# EAGLE design WindVane (EAGLE 9.6.2)
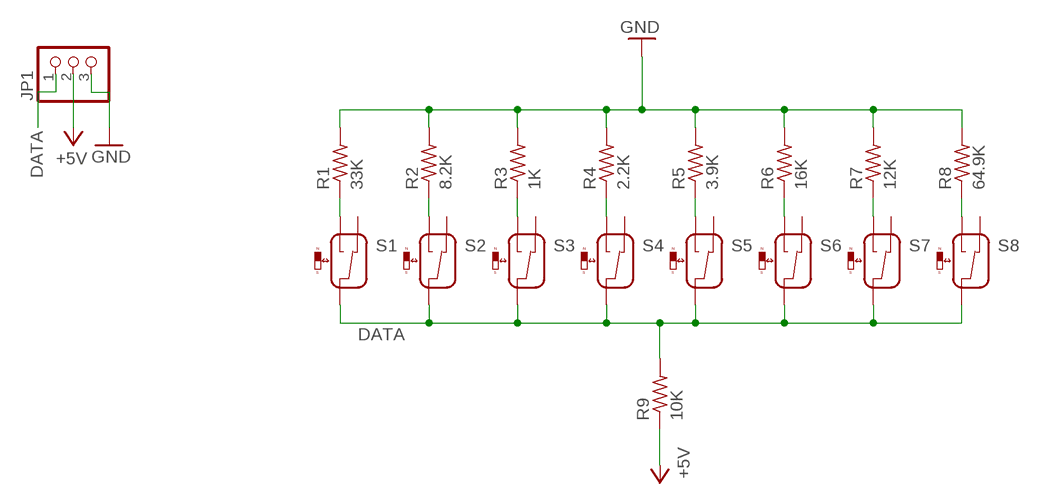
[diagram p0: schematic, sheet 1]

## Parts
JP1  PINHD-1X3/90  [1X03/90]
R1  33K  R-US_0207/10  [0207/10]
R2  8.2K  R-US_0207/10  [0207/10]
R3  1K  R-US_0207/10  [0207/10]
R4  2.2K  R-US_0207/10  [0207/10]
R5  3.9K  R-US_0207/10  [0207/10]
R6  16K  R-US_0207/10  [0207/10]
R7  12K  R-US_0207/10  [0207/10]
R8  64.9K  R-US_0207/10  [0207/10]
R9  10K  R-US_0207/10  [0207/10]
S1  REED-SWITCH-NO-NC  [MK6-8-C]
S2  REED-SWITCH-NO-NC  [MK6-8-C]
S3  REED-SWITCH-NO-NC  [MK6-8-C]
S4  REED-SWITCH-NO-NC  [MK6-8-C]
S5  REED-SWITCH-NO-NC  [MK6-8-C]
S6  REED-SWITCH-NO-NC  [MK6-8-C]
S7  REED-SWITCH-NO-NC  [MK6-8-C]
S8  REED-SWITCH-NO-NC  [MK6-8-C]

## Nets
+5V: JP1.2 R9.1
DATA: JP1.1 R9.2 S1.COM S2.COM S3.COM S4.COM S5.COM S6.COM S7.COM S8.COM
GND: JP1.3 R1.2 R2.2 R3.2 R4.2 R5.2 R6.2 R7.2 R8.2
N$2: R1.1 S1.NO
N$3: R2.1 S2.NO
N$4: R3.1 S3.NO
N$5: R4.1 S4.NO
N$6: R5.1 S5.NO
N$7: R6.1 S6.NO
N$8: R7.1 S7.NO
N$9: R8.1 S8.NO
Unconnected: S1.NC S2.NC S3.NC S4.NC S5.NC S6.NC S7.NC S8.NC

## Library data of the parts
JP1 = pinhead:PINHD-1X3: PIN HEADER
R1-R9 = rcl:R-US_: RESISTOR, American symbol; SPICEPREFIX: R
S1-S8 = switch-reed:REED-SWITCH-NO-NC: Reed Sensor NO NC

## Board
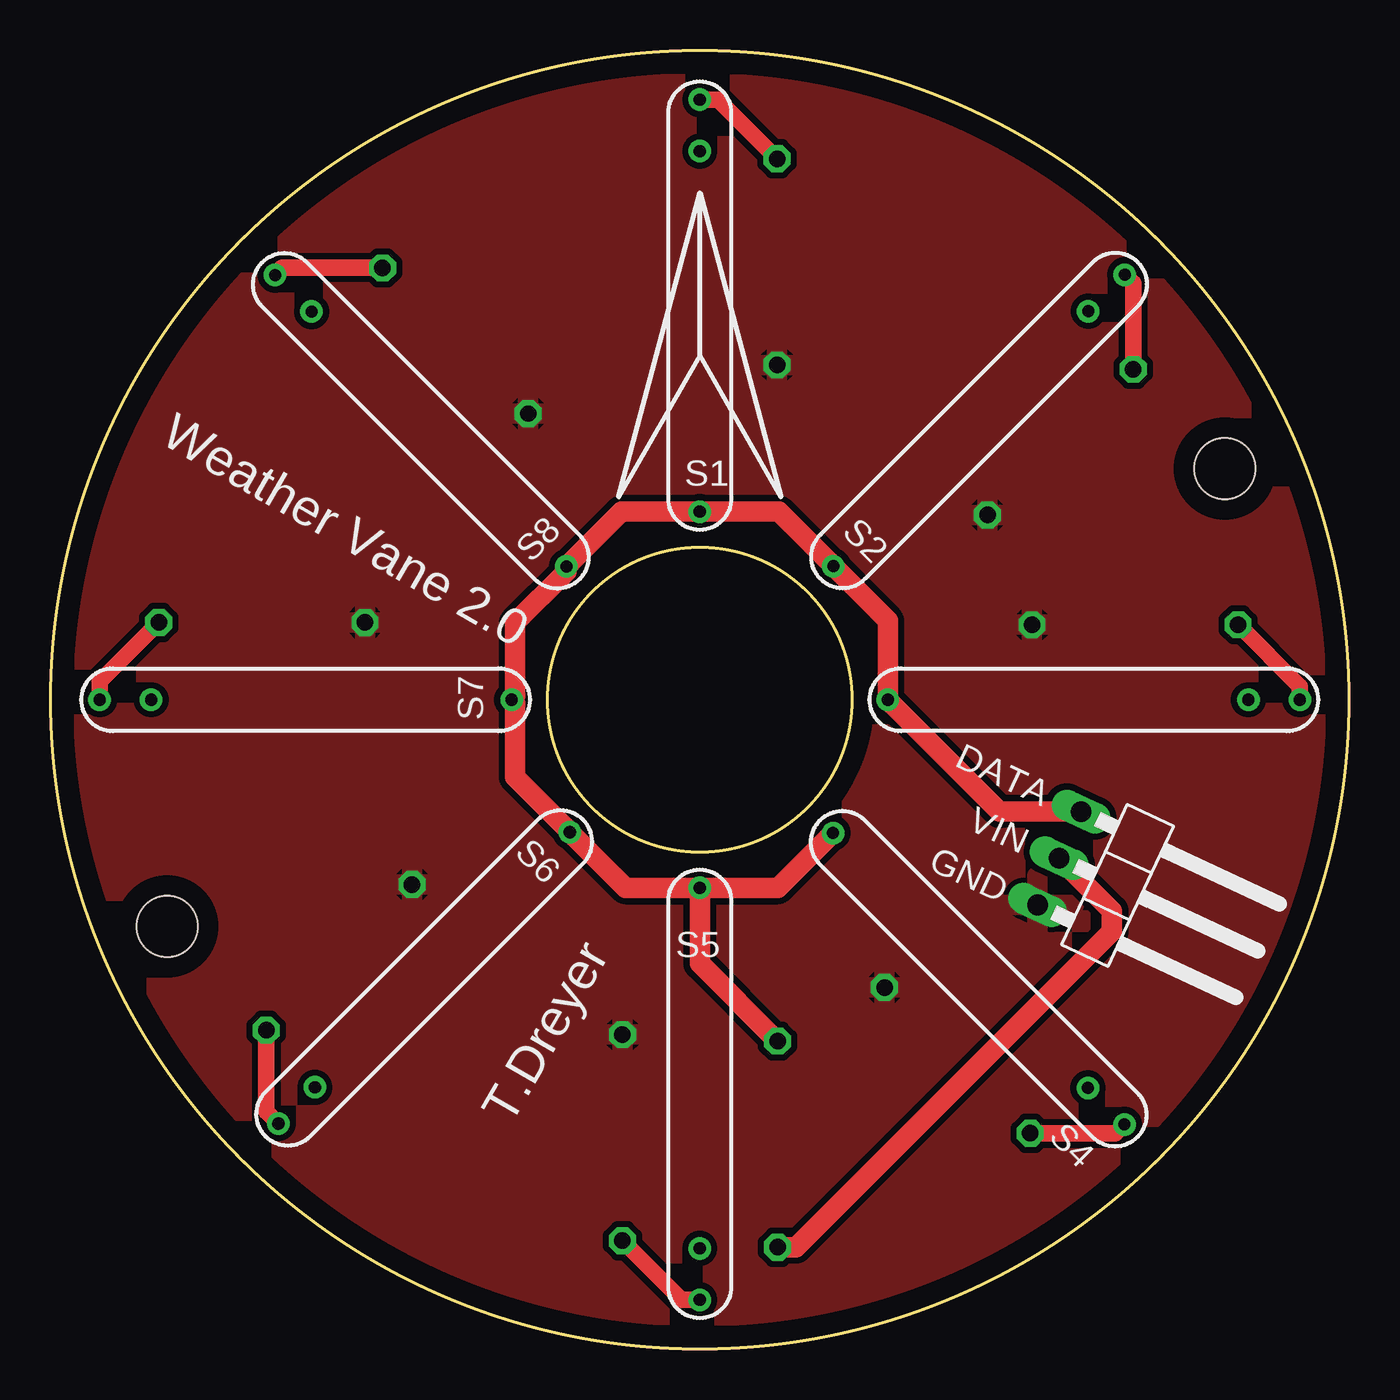
[diagram p1: board, top side]
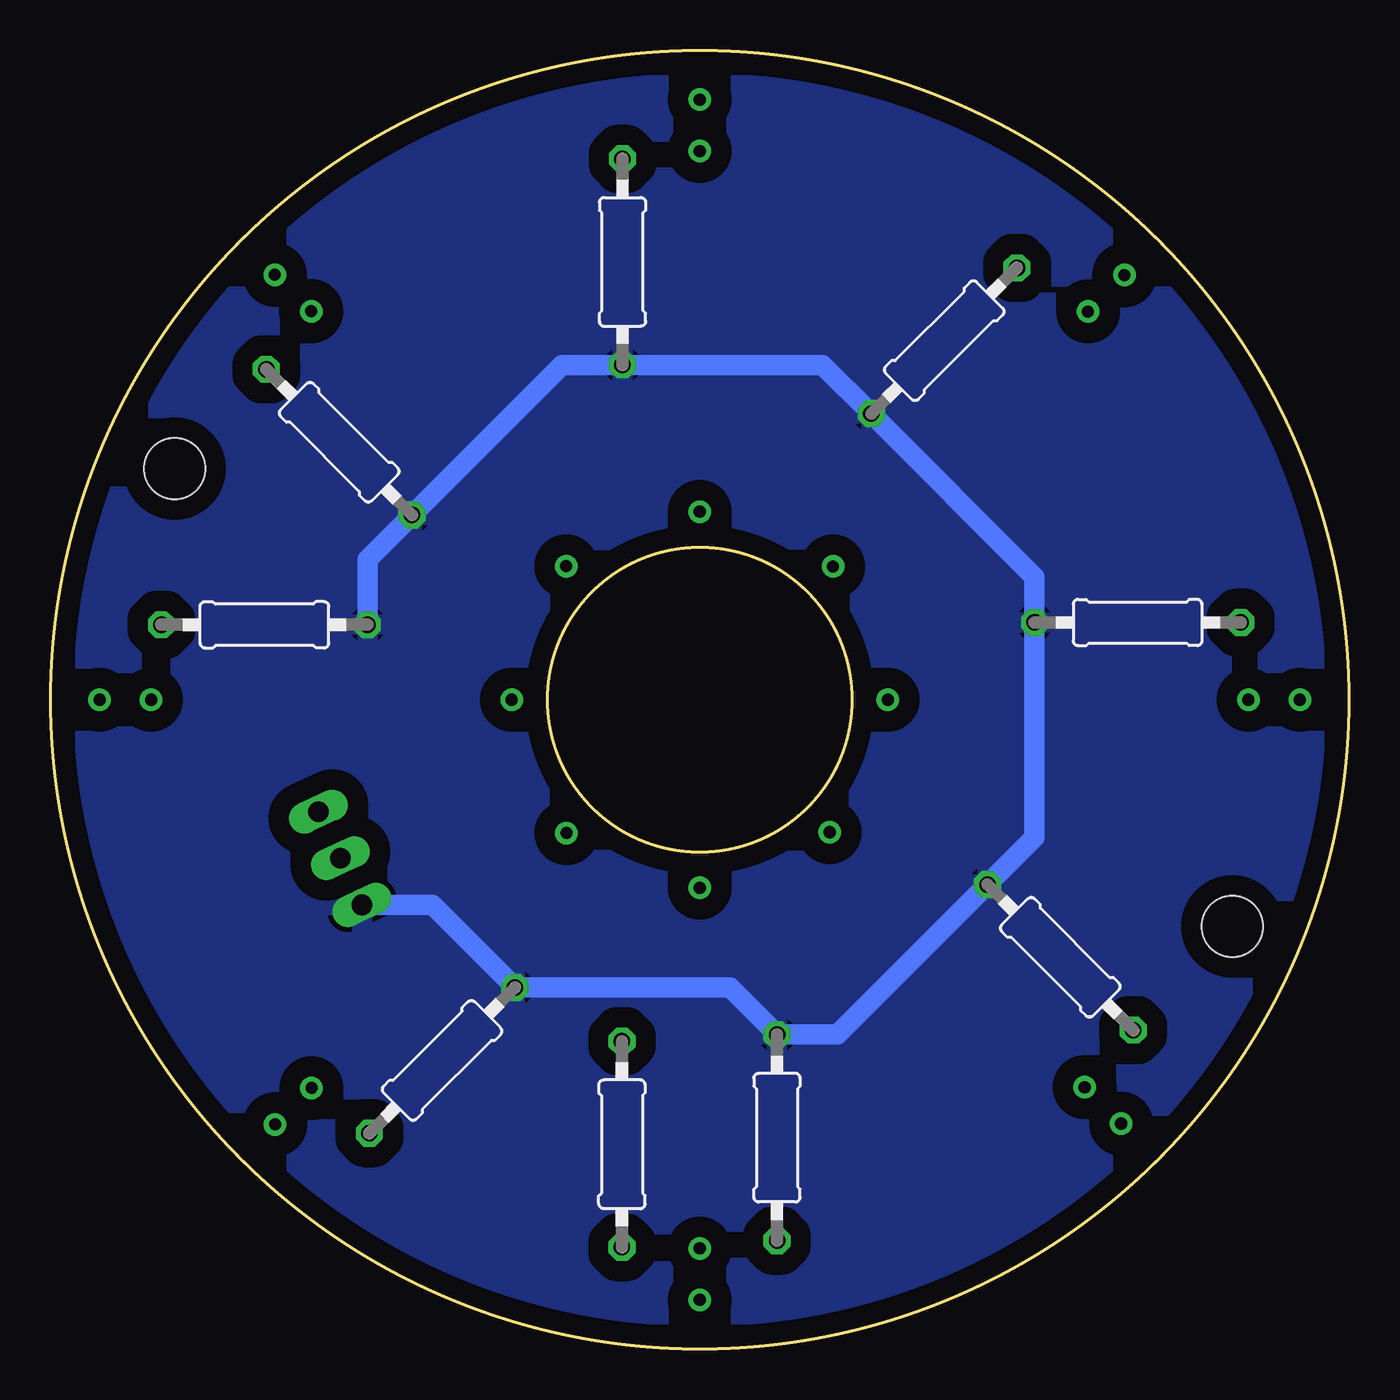
[diagram p2: board, bottom side, seen from below]

Size 64 x 64 mm. Coordinates in mm from the lower left corner, seen from the top.
Outline: circle at 32,32 radius 7.5
Outline: circle at 32,32 radius 32
Copper layers (1*16): Top 0.035mm / dielectric 1.5mm / Bottom 0.035mm
Design rules "default": minimum track width 6mil, minimum drill 0.35mm, track to track 6mil, track to pad 6mil, pad to pad 6mil, via to via 6mil, smd to smd 6mil, copper to edge 40mil, drill to drill 6mil, minimum pad ring 10mil, minimum via ring 8mil, stop-mask expansion 4mil, vias tented up to drill 0mil, thermal gap 10mil
Holes 3 mm at 5.75,20.82 57.88,43.39

### Footprints (pad centres in the part's own frame; a part is rotated, then mirrored left to right if it is on the bottom)
1X03/90 = drill 1.016 long: 1 -2.54,-3.81; 2 0,-3.81; 3 2.54,-3.81
0207/10 = drill 0.813 octagon: 1 -5.08,0; 2 5.08,0
MK6-8-C = drill 0.6 pad 1.016: COM 10.16,0; NC -7.62,0; NO -10.16,0

### Placement (x,y rotation side)
JP1  53.18,22.58 245 top
R1  35.81,53.59 270 bottom
R2  49.78,44.7 315 bottom
R3  53.46,35.7 0 bottom
R4  44.7,14.22 45 bottom
R5  28.19,10.41 90 bottom
R6  14.22,19.3 135 bottom
R7  10.41,35.81 180 bottom
R8  19.95,49.7 225 bottom
R9  35.84,10.08 90 bottom
S1  32,51.43 270 top
S2  45.77,45.77 225 top
S3  51.43,32 180 top
S4  45.75,18.25 135 top
S5  32,12.57 90 top
S6  18.41,18.28 45 top
S7  12.57,32 0 top
S8  18.25,45.75 315 top

### Tracks (layer width: path | path; a pad name or v marks a point on that pad's centre or on a via)
+5V
  Top 1.016: JP1.2 52.32,21.59 52.32,20.57 36.76,5 R9.1
DATA
  Top 1.016: JP1.1 46.78,26.49 S3.COM 41.27,35.9 S2.COM 35.9,41.27 S1.COM 28.13,41.27 S8.COM 25.43,38.33 22.9,35.8 22.9,32.17 S7.COM 22.9,31.83 22.9,28.18 25.59,25.49 S6.COM 28.33,22.73 S5.COM | S5.COM 35.87,22.73 S4.COM | R9.2 32,19 S5.COM
GND
  Bottom 1.016: R3.2 48.38,38.91 R2.2 38.79,48.51 R1.2 25.94,48.51 R8.2 15.49,38.06 R7.2 15.49,25.21 R6.2 25.21,15.49 R5.2 30.51,17.81 R4.2 45.18,21.88 JP1.3
  pour Top (isolate 0.305): -3.56,66.29 -3.56,-2.29 70.1,-2.29 70.1,66.29
  pour Bottom (isolate 1.016): -9.91,71.37 -9.91,-6.1 87.88,-6.1 87.88,71.37
N$2
  Top 0.813: R1.1 32.89,61.59 S1.NO
N$3
  Top 0.813: R2.1 53.37,52.53 S2.NO
N$4
  Top 0.813: S3.NO 61.59,32.65 R3.1
N$5
  Top 0.813: R4.1 52.5,10.63 S4.NO
N$6
  Top 0.813: R5.1 31.11,2.41 S5.NO
N$7
  Top 0.813: R6.1 10.63,11.7 S6.NO
N$8
  Top 0.813: R7.1 2.41,32.89 S7.NO
N$9
  Top 0.813: R8.1 11.42,53.29 S8.NO

### Text on the board
tPlace: Weather Vane 2.0 | DATA | VIN | GND | T.Dreyer